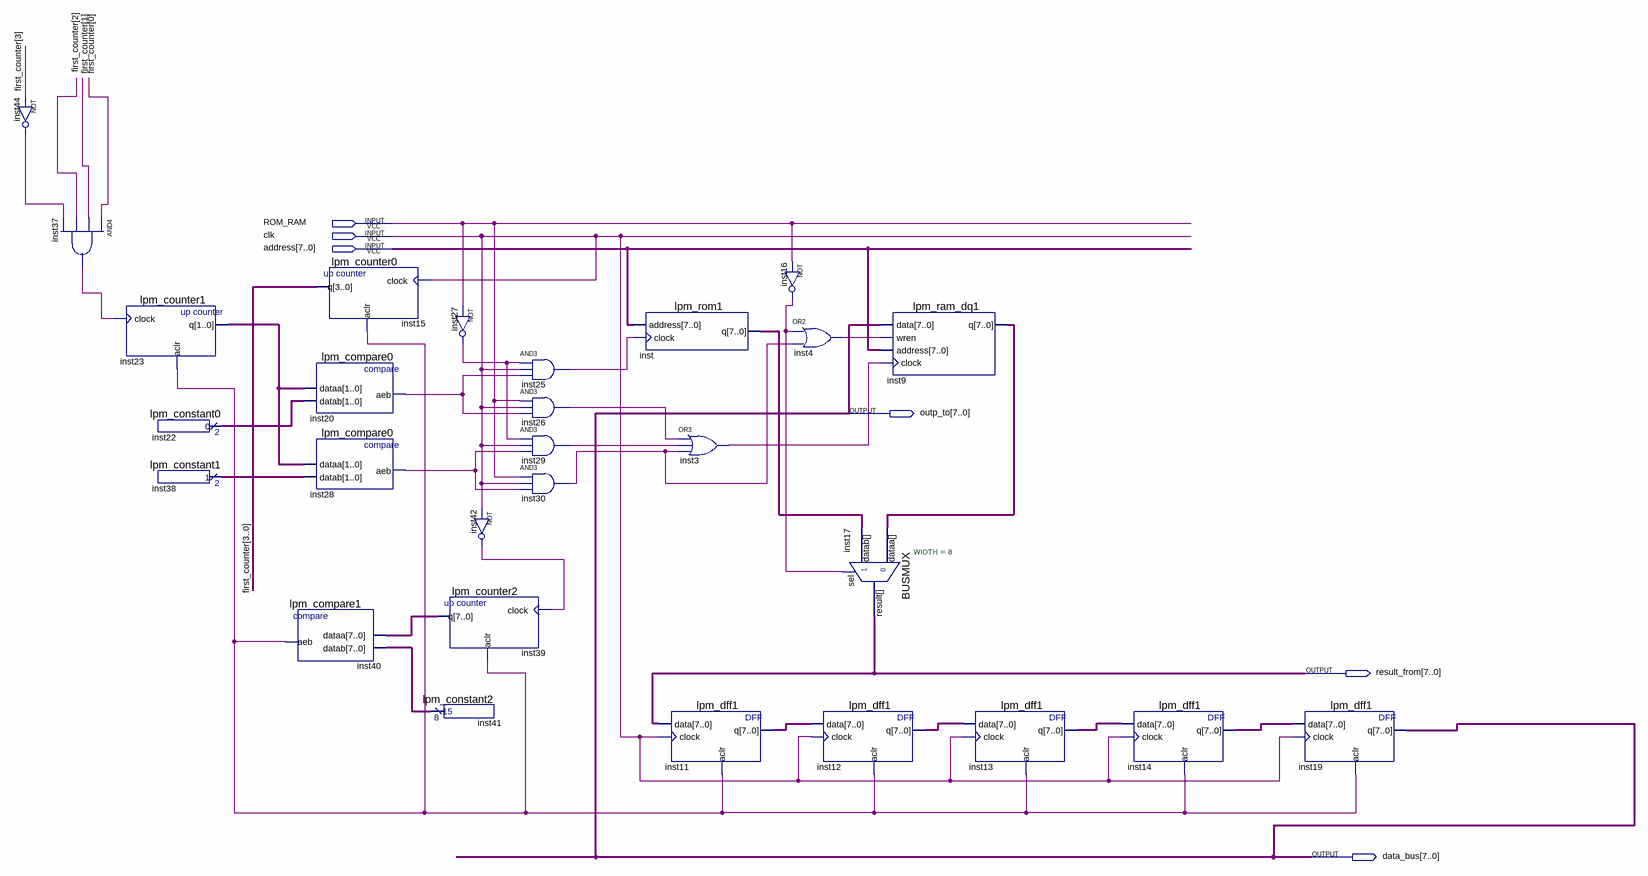
[diagram p0: schematic sheet]
// Quartus schematic lab3_v3.bdf as structural Verilog: 28 symbols, 6 pins
module lab3_v3 (
  input  ROM_RAM,
  input  clk,
  input  [7:0] address,
  output [7:0] outp_to,
  output [7:0] result_from,
  output [7:0] data_bus
);

  wire inst3_out, inst4_out, inst16_out, inst20_aeb, inst25_out, inst26_out, inst27_out, inst28_aeb,
       inst29_out, inst30_out, inst37_out, inst40_aeb, inst42_out, inst44_out;
  wire [1:0] inst22_result, inst23_q, inst38_result;
  wire [3:0] first_counter;
  wire [7:0] inst9_q, inst11_q, inst12_q, inst13_q, inst14_q, inst39_q, inst41_result, inst_q;

  not inst44 (inst44_out, first_counter[3]);
  and inst37 (inst37_out, first_counter[0], first_counter[1], first_counter[2], inst44_out);
  lpm_counter1 inst23 (.clock(inst37_out), .aclr(inst40_aeb), .q(inst23_q));
  lpm_constant0 inst22 (.result(inst22_result));
  lpm_constant1 inst38 (.result(inst38_result));
  lpm_counter0 inst15 (.clock(clk), .aclr(inst40_aeb), .q(first_counter));
  lpm_compare0 inst20 (.dataa(inst23_q), .datab(inst22_result), .aeb(inst20_aeb));
  lpm_compare0 inst28 (.dataa(inst23_q), .datab(inst38_result), .aeb(inst28_aeb));
  lpm_compare1 inst40 (.dataa(inst39_q), .datab(inst41_result), .aeb(inst40_aeb));
  lpm_constant2 inst41 (.result(inst41_result));
  not inst27 (inst27_out, ROM_RAM);
  not inst42 (inst42_out, clk);
  lpm_counter2 inst39 (.clock(inst42_out), .aclr(inst40_aeb), .q(inst39_q));
  and inst25 (inst25_out, inst27_out, clk, inst20_aeb);
  and inst26 (inst26_out, ROM_RAM, clk, inst20_aeb);
  and inst29 (inst29_out, inst27_out, clk, inst28_aeb);
  and inst30 (inst30_out, ROM_RAM, clk, inst28_aeb);
  lpm_rom1 inst (.address(address), .clock(inst25_out), .q(inst_q));
  or inst3 (inst3_out, inst26_out, inst29_out, inst30_out);
  lpm_dff1 inst11 (.data(result_from), .clock(clk), .aclr(inst40_aeb), .q(inst11_q));
  not inst16 (inst16_out, ROM_RAM);
  or inst4 (inst4_out, inst16_out, inst30_out);
  lpm_dff1 inst12 (.data(inst11_q), .clock(clk), .aclr(inst40_aeb), .q(inst12_q));
  lpm_ram_dq1 inst9 (.data(data_bus), .wren(inst4_out), .address(address), .clock(inst3_out), .q(inst9_q));
  BUSMUX #(.WIDTH(8)) inst17 (.datab(inst_q), .sel(inst16_out), .dataa(inst9_q), .result(result_from));
  lpm_dff1 inst13 (.data(inst12_q), .clock(clk), .aclr(inst40_aeb), .q(inst13_q));
  lpm_dff1 inst14 (.data(inst13_q), .clock(clk), .aclr(inst40_aeb), .q(inst14_q));
  lpm_dff1 inst19 (.data(inst14_q), .clock(clk), .aclr(inst40_aeb), .q(data_bus));

  assign outp_to = data_bus;
endmodule
